# EAGLE design IRC2K16 (EAGLE 6.1)
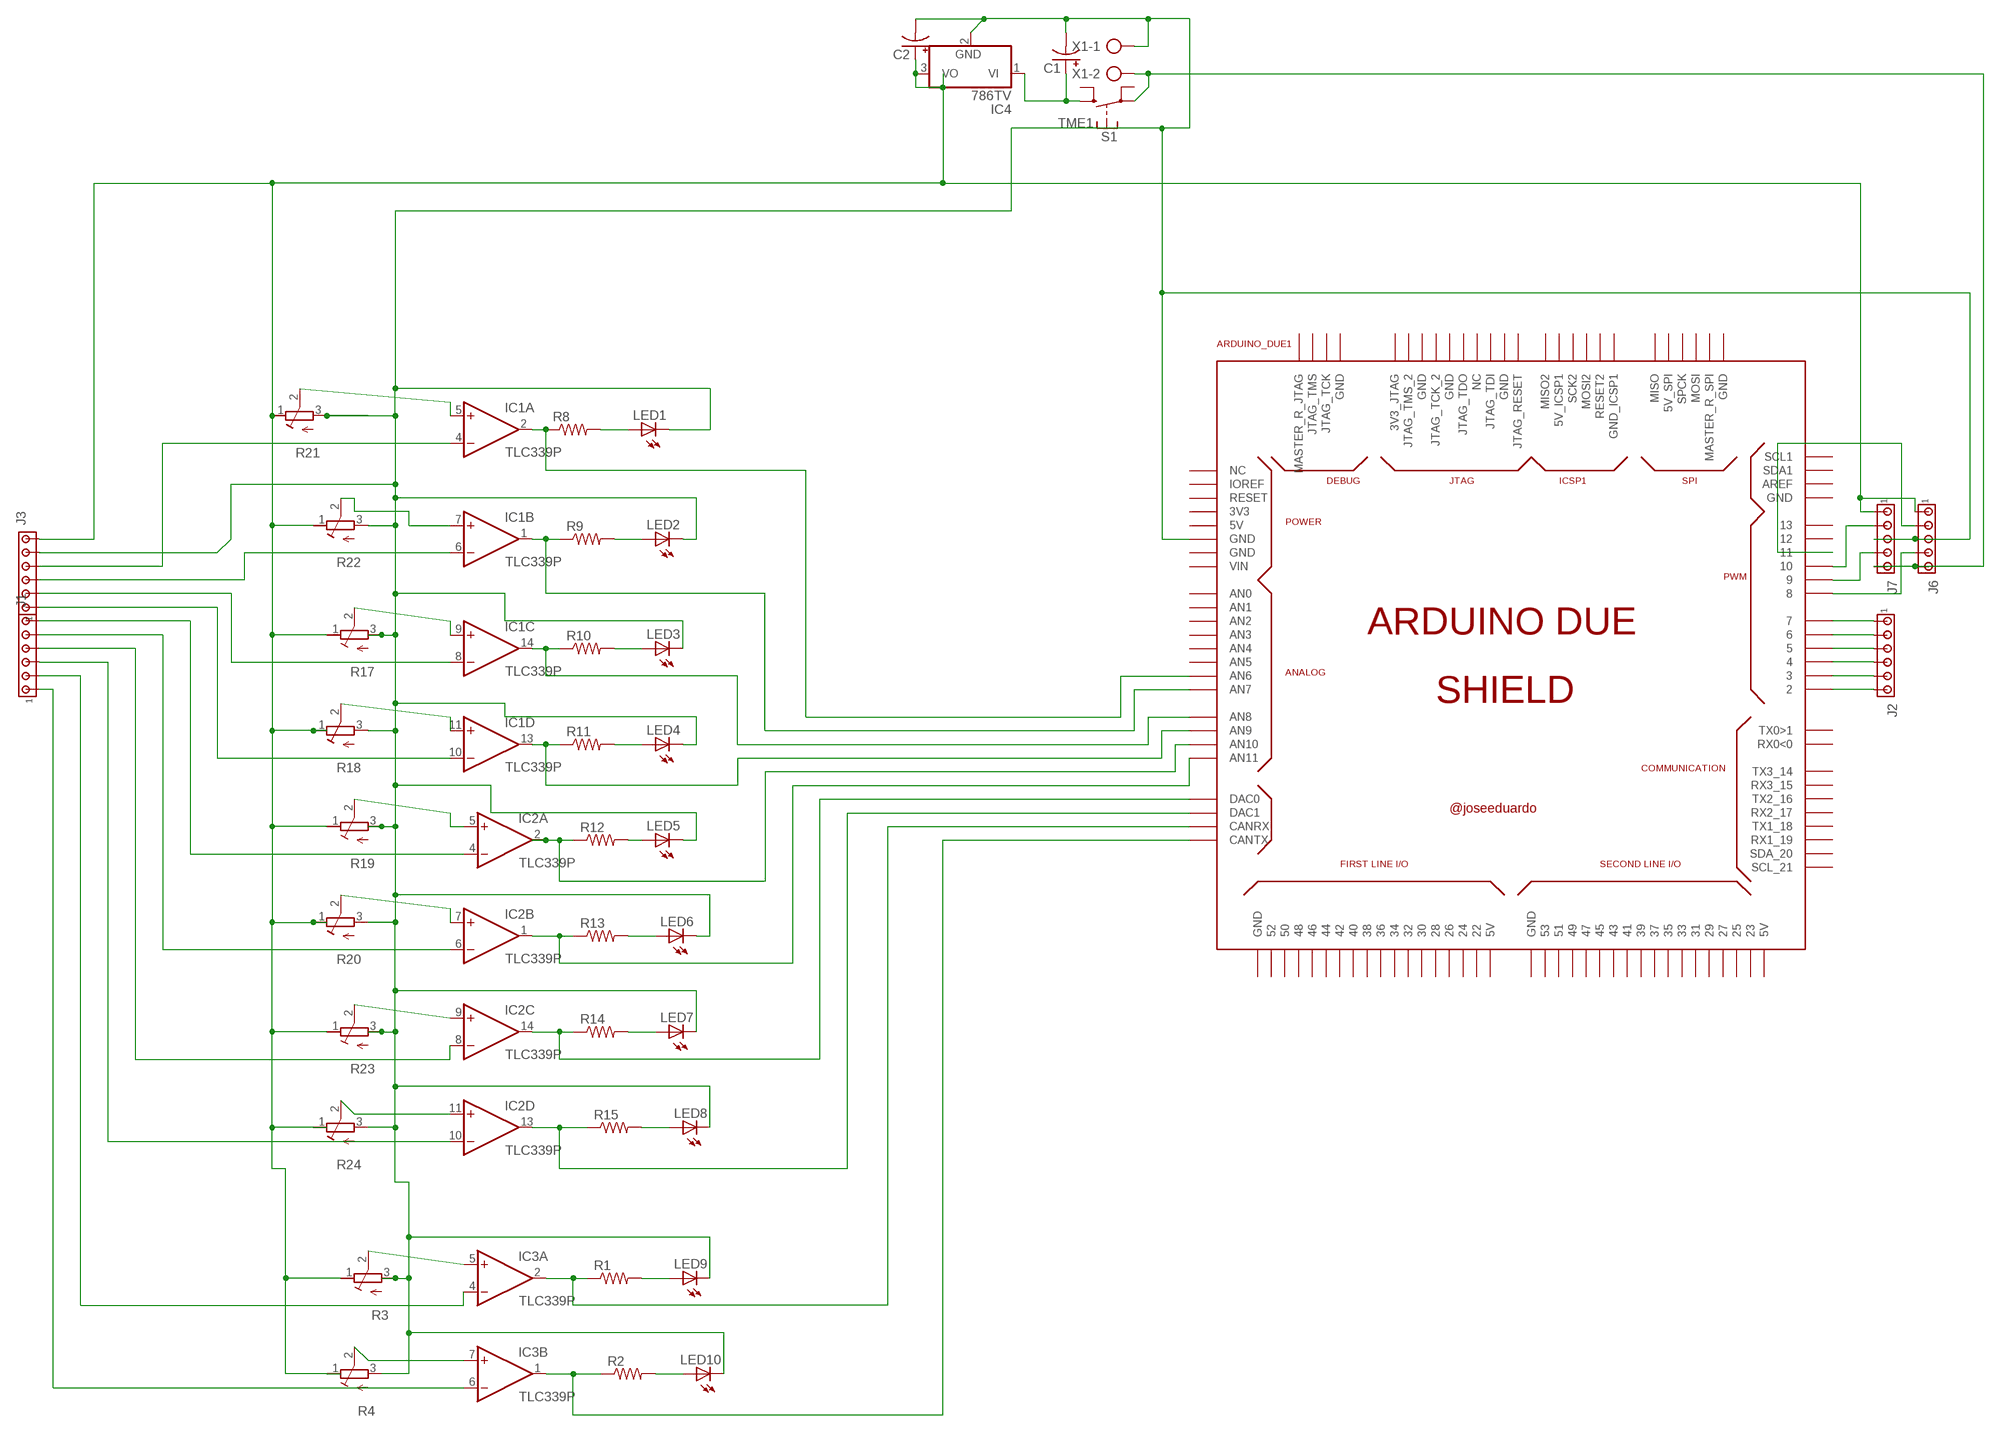
[diagram p0: schematic, sheet 1]

## Parts
ARDUINO_DUE1  ARDUINO_DUE_SHIELD  [ARDUINO_DUE_SHIELD]
C1  CPOL-USE5-10.5  [E5-10,5]
C2  CPOL-USE5-10.5  [E5-10,5]
IC1  TLC339P  [DIL14]
IC2  TLC339P  [DIL14]
IC3  TLC339P  [DIL14]
IC4  786TV  [TO220V]
J1  MTA06-100  [10X06MTA]
J2  MTA06-100  [10X06MTA]
J3  MTA06-100  [10X06MTA]
J6  MTA05-100  [10X05MTA]
J7  MTA05-100  [10X05MTA]
LED1  LED3MM  [LED3MM]
LED2  LED3MM  [LED3MM]
LED3  LED3MM  [LED3MM]
LED4  LED3MM  [LED3MM]
LED5  LED3MM  [LED3MM]
LED6  LED3MM  [LED3MM]
LED7  LED3MM  [LED3MM]
LED8  LED3MM  [LED3MM]
LED9  LED3MM  [LED3MM]
LED10  LED3MM  [LED3MM]
R1  R-US_0207/10  [0207/10]
R2  R-US_0207/10  [0207/10]
R3  R-TRIMMT93YA  [RTRIMT93YA]
R4  R-TRIMMT93YA  [RTRIMT93YA]
R8  R-US_0207/10  [0207/10]
R9  R-US_0207/10  [0207/10]
R10  R-US_0207/10  [0207/10]
R11  R-US_0207/10  [0207/10]
R12  R-US_0207/10  [0207/10]
R13  R-US_0207/10  [0207/10]
R14  R-US_0207/10  [0207/10]
R15  R-US_0207/10  [0207/10]
R17  R-TRIMMT93YA  [RTRIMT93YA]
R18  R-TRIMMT93YA  [RTRIMT93YA]
R19  R-TRIMMT93YA  [RTRIMT93YA]
R20  R-TRIMMT93YA  [RTRIMT93YA]
R21  R-TRIMMT93YA  [RTRIMT93YA]
R22  R-TRIMMT93YA  [RTRIMT93YA]
R23  R-TRIMMT93YA  [RTRIMT93YA]
R24  R-TRIMMT93YA  [RTRIMT93YA]
S1  TME1  [TME1]
X1  AK300/2  [AK300/2]

## Nets
N$1: ARDUINO_DUE1.7 J2.6
N$2: IC1.4(A:-IN) J3.3
N$3: ARDUINO_DUE1.6 J2.5
N$4: IC1.6(B:-IN) J3.4
N$5: IC1.7(B:+IN) R22.2(S)
N$6: IC1.5(A:+IN) R21.2(S)
N$7: IC1.9(C:+IN) R17.2(S)
N$8: IC1.11(D:+IN) R18.2(S)
N$9: IC2.5(A:+IN) R19.2(S)
N$10: IC2.7(B:+IN) R20.2(S)
N$11: IC2.9(C:+IN) R23.2(S)
N$12: IC2.11(D:+IN) R24.2(S)
N$13: ARDUINO_DUE1.A6(AN6) IC1.2(A:OUT) R8.1
N$14: LED1.A R8.2
N$15: ARDUINO_DUE1.A7(AN7) IC1.1(B:OUT) R9.1
N$16: LED2.A R9.2
N$17: ARDUINO_DUE1.A8(AN8) IC1.14(C:OUT) R10.1
N$18: LED3.A R10.2
N$19: ARDUINO_DUE1.A9(AN9) IC1.13(D:OUT) R11.1
N$20: ARDUINO_DUE1.A10(AN10) IC2.2(A:OUT) R12.1
N$21: ARDUINO_DUE1.A11(AN11) IC2.1(B:OUT) R13.1
N$22: ARDUINO_DUE1.DAC0 IC2.14(C:OUT) R14.1
N$23: LED4.A R11.2
N$24: LED5.A R12.2
N$25: LED6.A R13.2
N$26: LED7.A R14.2
N$27: ARDUINO_DUE1.DAC1 IC2.13(D:OUT) R15.1
N$28: LED8.A R15.2
N$29: IC1.8(C:-IN) J3.5
N$30: ARDUINO_DUE1.5 J2.4
N$31: IC1.10(D:-IN) J3.6
N$32: IC2.4(A:-IN) J1.1
N$33: IC2.6(B:-IN) J1.2
N$34: IC2.8(C:-IN) J1.3
N$35: ARDUINO_DUE1.4 J2.3
N$36: ARDUINO_DUE1.3 J2.2
N$37: ARDUINO_DUE1.2 J2.1
N$38: IC2.10(D:-IN) J1.4
N$39: J6.5 J7.5 S1.2(P) X1.2
N$40: IC3.5(A:+IN) R3.2(S)
N$41: ARDUINO_DUE1.8 J6.4
N$42: IC3.7(B:+IN) R4.2(S)
N$43: ARDUINO_DUE1.CANRX IC3.2(A:OUT) R1.1
N$44: LED9.A R1.2
N$45: ARDUINO_DUE1.CANTX IC3.1(B:OUT) R2.1
N$46: LED10.A R2.2
N$47: IC3.4(A:-IN) J1.5
N$48: IC3.6(B:-IN) J1.6
N$49: C2.+ IC4.3(VO) J3.1 J6.1 J7.1 R3.1(A) R4.1(A) R17.1(A) R18.1(A) R19.1(A) R20.1(A) R21.1(A) R22.1(A) R23.1(A) R24.1(A)
N$55: ARDUINO_DUE1.GND C1.- C2.- IC4.2(GND) J3.2 J6.3 J7.3 LED1.K(C) LED2.K(C) LED3.K(C) LED4.K(C) LED5.K(C) LED6.K(C) LED7.K(C) LED8.K(C) LED9.K(C) LED10.K(C) R3.3(E) R4.3(E) R17.3(E) R18.3(E) R19.3(E) R20.3(E) R21.3(E) R22.3(E) R23.3(E) R24.3(E) X1.1
N$60: ARDUINO_DUE1.10 J7.2
N$61: ARDUINO_DUE1.11 J6.2
N$62: ARDUINO_DUE1.9 J7.4
N$63: C1.+ IC4.1(VI) S1.1(S)
Unconnected: ARDUINO_DUE1.0(RX0<0) ARDUINO_DUE1.1(TX0>1) ARDUINO_DUE1.3V3 ARDUINO_DUE1.3V3_JTAG ARDUINO_DUE1.5V0(5V) ARDUINO_DUE1.5V0_1(5V) ARDUINO_DUE1.5V0_2(5V) ARDUINO_DUE1.5V_2(5V_SPI) ARDUINO_DUE1.5V_ICSP1 ARDUINO_DUE1.12 ARDUINO_DUE1.13 ARDUINO_DUE1.14(TX3_14) ARDUINO_DUE1.15(RX3_15) ARDUINO_DUE1.16(TX2_16) ARDUINO_DUE1.17(RX2_17) ARDUINO_DUE1.18(TX1_18) ARDUINO_DUE1.19(RX1_19) ARDUINO_DUE1.20(SDA_20) ARDUINO_DUE1.21(SCL_21) ARDUINO_DUE1.22 ARDUINO_DUE1.23 ARDUINO_DUE1.24 ARDUINO_DUE1.25 ARDUINO_DUE1.26 ARDUINO_DUE1.27 ARDUINO_DUE1.28 ARDUINO_DUE1.29 ARDUINO_DUE1.30 ARDUINO_DUE1.31 ARDUINO_DUE1.32 ARDUINO_DUE1.33 ARDUINO_DUE1.34 ARDUINO_DUE1.35 ARDUINO_DUE1.36 ARDUINO_DUE1.37 ARDUINO_DUE1.38 ARDUINO_DUE1.39 ARDUINO_DUE1.40 ARDUINO_DUE1.41 ARDUINO_DUE1.42 ARDUINO_DUE1.43 ARDUINO_DUE1.44 ARDUINO_DUE1.45 ARDUINO_DUE1.46 ARDUINO_DUE1.47 ARDUINO_DUE1.48 ARDUINO_DUE1.49 ARDUINO_DUE1.50 ARDUINO_DUE1.51 ARDUINO_DUE1.52 ARDUINO_DUE1.53 ARDUINO_DUE1.A0(AN0) ARDUINO_DUE1.A1(AN1) ARDUINO_DUE1.A2(AN2) ARDUINO_DUE1.A3(AN3) ARDUINO_DUE1.A4(AN4) ARDUINO_DUE1.A5(AN5) ARDUINO_DUE1.AREF ARDUINO_DUE1.GND_1(GND) ARDUINO_DUE1.GND_2(GND) ARDUINO_DUE1.GND_3(GND) ARDUINO_DUE1.GND_4(GND) ARDUINO_DUE1.GND_5(GND) ARDUINO_DUE1.GND_7(GND) ARDUINO_DUE1.GND_8(GND) ARDUINO_DUE1.GND_9(GND) ARDUINO_DUE1.GND_10(GND) ARDUINO_DUE1.GND_ICSP1 ARDUINO_DUE1.IOREF ARDUINO_DUE1.JTAG_RESET ARDUINO_DUE1.JTAG_TCK ARDUINO_DUE1.JTAG_TCK_2 ARDUINO_DUE1.JTAG_TDI ARDUINO_DUE1.JTAG_TDO ARDUINO_DUE1.JTAG_TMS ARDUINO_DUE1.JTAG_TMS_2 ARDUINO_DUE1.MASTER_RESET_JTAG(MASTER_R_JTAG) ARDUINO_DUE1.MASTER_RESET_SPI(MASTER_R_SPI) ARDUINO_DUE1.MISO ARDUINO_DUE1.MISO2 ARDUINO_DUE1.MOSI ARDUINO_DUE1.MOSI2 ARDUINO_DUE1.NC_2(NC) ARDUINO_DUE1.NC_5(NC) ARDUINO_DUE1.RESET ARDUINO_DUE1.RESET2 ARDUINO_DUE1.SCK2 ARDUINO_DUE1.SCL1 ARDUINO_DUE1.SDA1 ARDUINO_DUE1.SPCK ARDUINO_DUE1.VIN IC3.8(C:-IN) IC3.9(C:+IN) IC3.10(D:-IN) IC3.11(D:+IN) IC3.13(D:OUT) IC3.14(C:OUT) S1.4(P) S1.5(S)

## Power pins joined to a net without a drawn wire
V+: IC1.3(P:V+) IC2.3(P:V+) IC3.3(P:V+)
V-: IC1.12(P:V-) IC2.12(P:V-) IC3.12(P:V-)

## Library data of the parts
ARDUINO_DUE1 = arduino_due_shield:ARDUINO_DUE_SHIELD
C1 C2 = adafruit:CPOL-US: POLARIZED CAPACITOR, American symbol
IC1-IC3 = linear:TLC339: COMPARATOR
IC4 = linear:78*: Positive VOLTAGE REGULATOR Source: http://cache.national.com/ds/LM/LM78L05.pdf http://www.fairchildsemi.com/ds/LM/LM7805.pdf
J1-J3 = con-amp:MTA06-100: AMP connector
J6 J7 = con-amp:MTA05-100: AMP connector
LED1-LED10 = adafruit:LED: LED OSRAM: - CHIPLED LG R971, LG N971, LY N971, LG Q971, LY Q971, LO R971, LY R971 LH N974, LH R974 LS Q976, LO Q976, LY Q976 LO Q996 - Hyper CHIPLED LW Q18S LB Q993, LB Q99A, LB R99A - SideLED LS A670, LO A670, LY A670, LG A670, LP A670 LB A673, LV A673, LT A673, LW A673 LH A674 LY A675 LS A676, LA A676, LO A676, LY A676, LW A676 LS A679, LY A679, LG A679 - Hyper Micro SIDELED® LS Y876, LA Y876, LO Y876, LY Y876 LT Y87S - SmartLED LW L88C, LW L88S LB L89C, LB L89S, LG L890 LS L89K, LO L89K, LY L89K LS L896, LA L896, LO L896, LY L896 - TOPLED LS T670, LO T670, LY T670, LG T670, LP T670 LSG T670, LSP T670, LSY T670, LOP T670, LYG T670 LG T671, LOG T671, LSG T671 LB T673, LV T673, LT T673, LW T673 LH T674 LS T676, LA T676, LO T676, LY T676, LB T676, LH T676, LSB T676, LW T676 LB T67C, LV T67C, LT T67C, LS T67K, LO T67K, LY T67K, LW E67C LS E67B, LA E67B, LO E67B, LY E67B, LB E67C, LV E67C, LT E67C LW T67C LS T679, LY T679, LG T679 LS T770, LO T770, LY T770, LG T770, LP T770 LB T773, LV T773, LT T773, LW T773 LH T774 LS E675, LA E675, LY E675, LS T675 LS T776, LA T776, LO T776, LY T776, LB T776 LHGB T686 LT T68C, LB T68C - Hyper Mini TOPLED® LB M676 - Mini TOPLED Santana® LG M470 LS M47K, LO M47K, LY M47K Source: http://www.osram.convergy.de/
R1 R2 R8-R15 = adafruit:R-US_: RESISTOR, American symbol
R3 R4 R17-R24 = rcl:R-TRIMM: Trimm resistor
S1 = switch-misc:TME1: SWITCH
X1 = con-ptr500:AK300/2: CONNECTOR

## Board
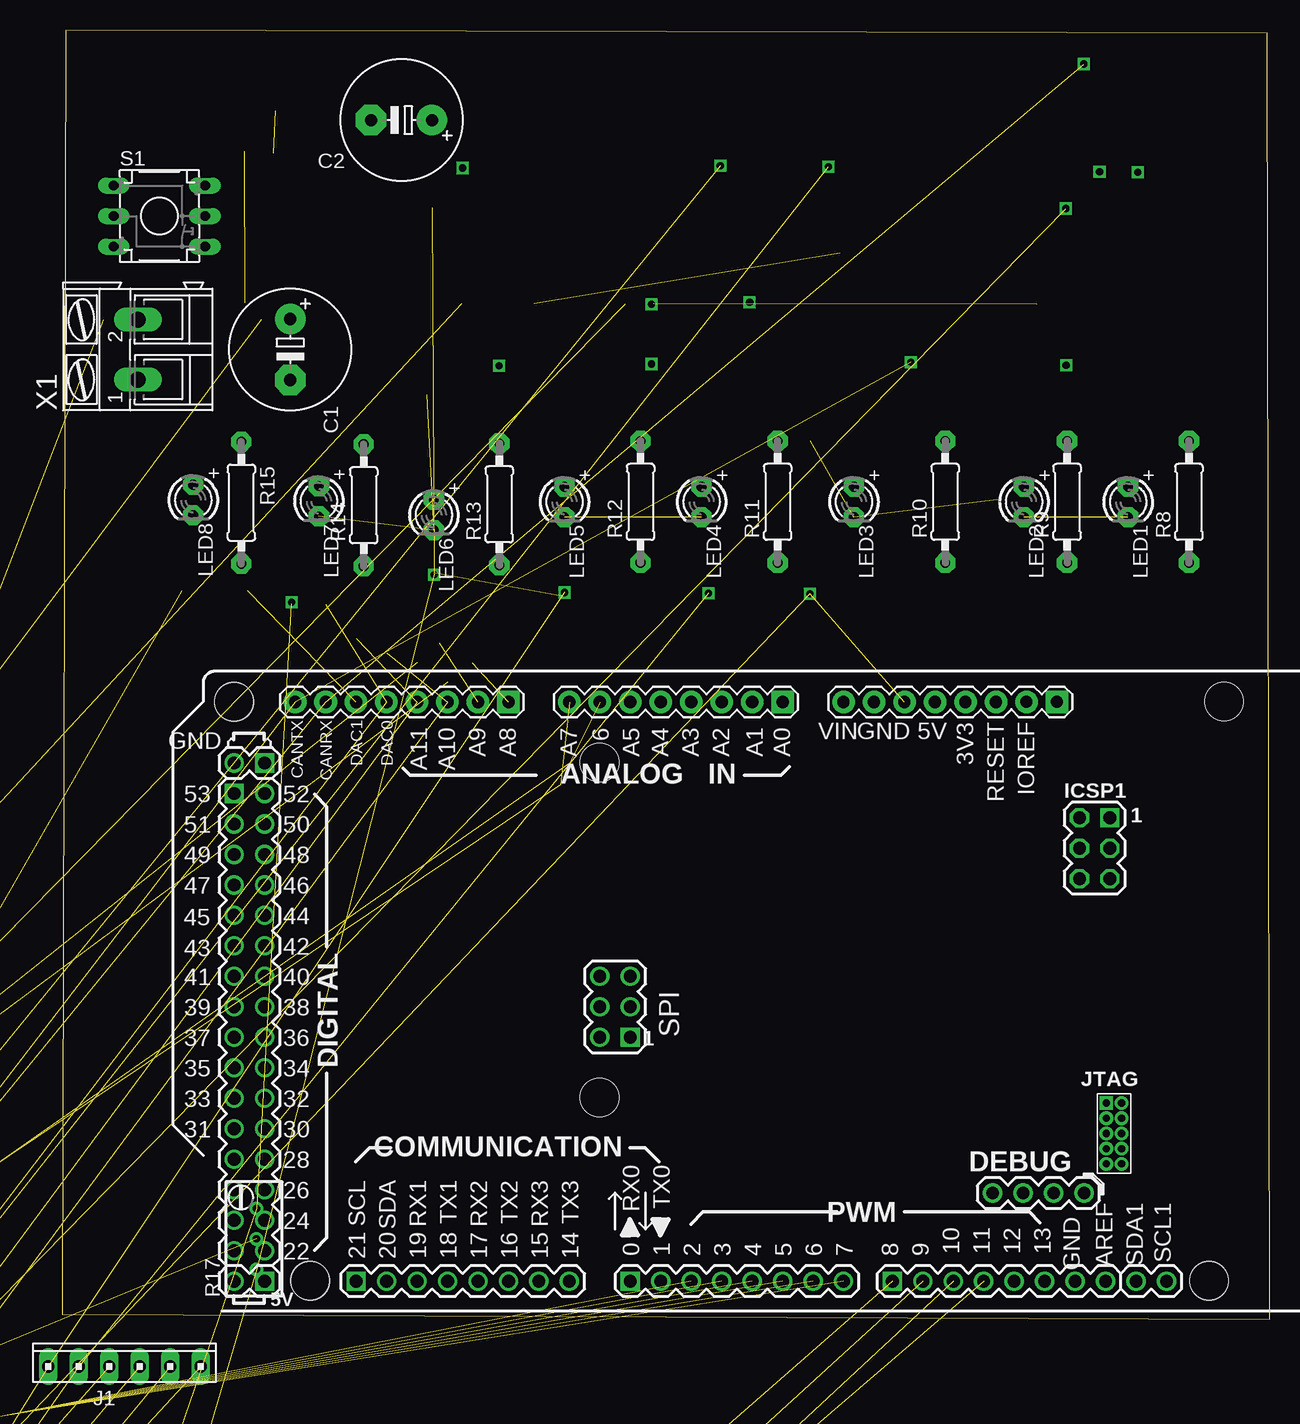
[diagram p1: board, top side]
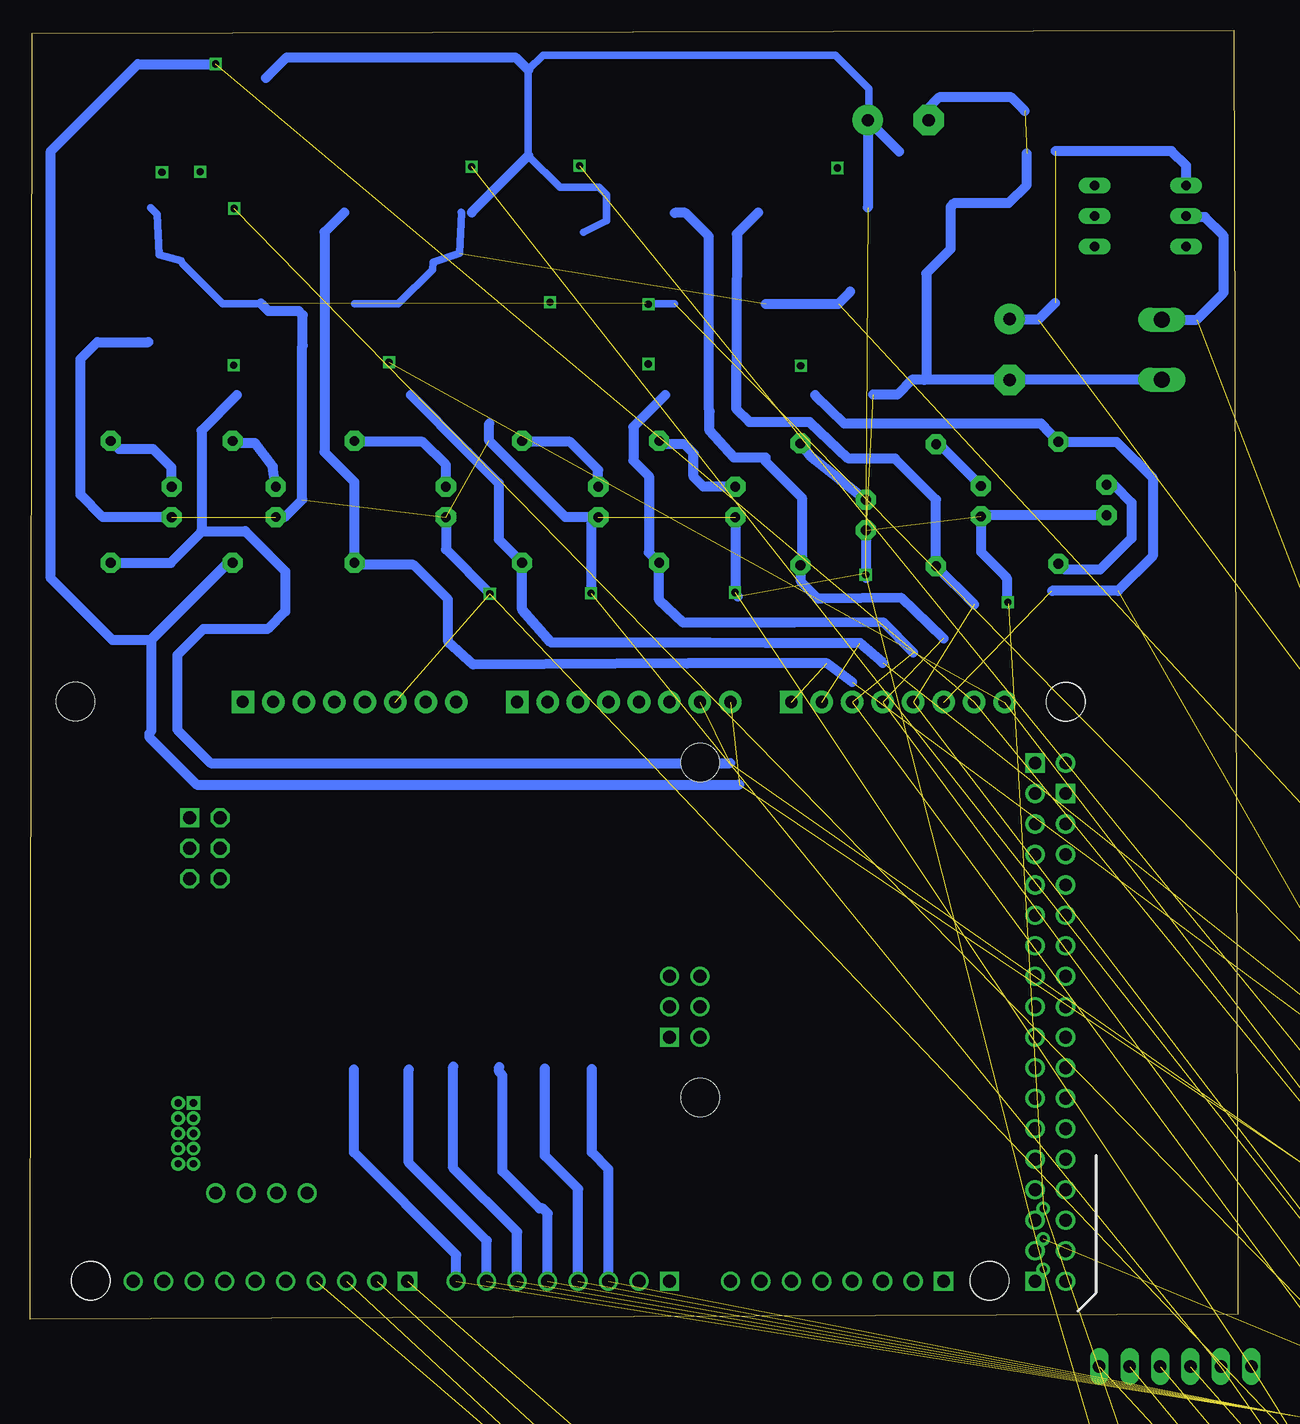
[diagram p2: board, bottom side, seen from below]

Size 100.68 x 107.43 mm. Coordinates in mm from the lower left corner, seen from the top.
Outline: 0,0.4 100.68,0 100.49,107.15 0.32,107.43 0,0.4
Copper layers (1*16): Top 0.035mm / dielectric 1.5mm / Bottom 0.035mm
Design rules: minimum track width 10mil, minimum drill 24mil, track to track 8mil, track to pad 8mil, pad to pad 8mil, via to via 8mil, smd to smd 8mil, copper to edge 40mil, drill to drill 8mil, minimum pad ring 10mil, minimum via ring 8mil, stop-mask expansion 4mil, vias tented up to drill 0mil, thermal gap 10mil

### Footprints (pad centres in the part's own frame; a part is rotated, then mirrored left to right if it is on the bottom)
ARDUINO_DUE_SHIELD = drill 1.067 square: 0 63.373,51.816; 5V0_1 93.853,51.816; 8 41.529,51.816; 21 86.233,51.816; 53 96.393,11.176; GND_2 93.853,8.636; MISO 63.373,31.496; MISO2 23.384,13.196 | drill 1.067: 1 60.833,51.816; 2 58.293,51.816; 3 55.753,51.816; 4 53.213,51.816; 5 50.673,51.816; 5V0_2 96.393,51.816; 5V_2 65.913,31.496; 6 48.133,51.816; 7 45.593,51.816; 9 38.989,51.816; 10 36.449,51.816; 11 33.909,51.816; 12 31.369,51.816; 13 28.829,51.816; 14 68.453,51.816; 15 70.993,51.816; 16 73.533,51.816; 17 76.073,51.816; 18 78.613,51.816; 19 81.153,51.816; 20 83.693,51.816; 22 93.853,49.276; 23 96.393,49.276; 24 93.853,46.736; 25 96.393,46.736; 26 93.853,44.196; 27 96.393,44.196; 28 93.853,41.656; 29 96.393,41.656; 30 93.853,39.116; 31 96.393,39.116; 32 93.853,36.576; 33 96.393,36.576; 34 93.853,34.036; 35 96.393,34.036; 36 93.853,31.496; 37 96.393,31.496; 38 93.853,28.956; 39 96.393,28.956; 40 93.853,26.416; 41 96.393,26.416; 42 93.853,23.876; 43 96.393,23.876; 44 93.853,21.336; 45 96.393,21.336; 46 93.853,18.796; 47 96.393,18.796; 48 93.853,16.256; 49 96.393,16.256; 50 93.853,13.716; 51 96.393,13.716; 52 93.853,11.176; AREF 23.749,51.816; GND_3 96.393,8.636; GND_4 26.289,51.816; GND_5 65.913,26.416; GND_7 33.161,44.473; JTAG_TCK 30.621,44.473; JTAG_TMS 28.081,44.473; MASTER_RESET_JTAG 25.541,44.473; MASTER_RESET_SPI 63.373,26.416; MOSI 65.913,28.956; SCL1 18.669,51.816; SDA1 21.209,51.816; SPCK 63.373,28.956 | drill 1.016 pad 1.88: 3V3 35.433,3.556; 5V0 37.973,3.556; A1 53.213,3.556; A2 55.753,3.556; A3 58.293,3.556; A4 60.833,3.556; A5 63.373,3.556; A6 65.913,3.556; A7 68.453,3.556; A9 76.073,3.556; A10 78.613,3.556; A11 81.153,3.556; CANRX 88.773,3.556; CANTX 91.313,3.556; DAC0 83.693,3.556; DAC1 86.233,3.556; GND 40.513,3.556; GND_1 43.053,3.556; IOREF 30.346,3.543; RESET 32.893,3.555; VIN 45.593,3.556 | drill 0.6 pad 1.016 square: 3V3_JTAG 23.689,36.964 | drill 1.067 octagon: 5V_ICSP1 25.924,13.196; GND_ICSP1 25.924,18.276; MOSI2 25.924,15.736; RESET2 23.384,18.276; SCK2 23.384,15.736 | drill 1.016 pad 1.88 square: A0 50.673,3.556; A8 73.533,3.556; NC_2 27.806,3.543 | drill 0.6 pad 1.143: GND_8 23.689,38.234; GND_9 23.689,40.774; GND_10 23.689,42.044; JTAG_RESET 22.419,42.044; JTAG_TCK_2 22.419,38.234; JTAG_TDI 22.419,40.774; JTAG_TDO 22.419,39.504; JTAG_TMS_2 22.419,36.964; NC_5 23.689,39.504 | hole 3.2: 15.113,51.816; 90.043,51.816; 96.393,3.556; 96.418,3.505; 15.138,51.765; 90.068,51.765; 13.868,3.505; 65.938,36.525; 65.938,8.585
E5-10,5 = drill 1.016 pad 2.54: + -2.54,0 | drill 1.016 pad 2.54 octagon: - 2.54,0
DIL14 = drill 0.813 long: 1 -7.62,-3.81; 2 -5.08,-3.81; 3 -2.54,-3.81; 4 0,-3.81; 5 2.54,-3.81; 6 5.08,-3.81; 7 7.62,-3.81; 8 7.62,3.81; 9 5.08,3.81; 10 2.54,3.81; 11 0,3.81; 12 -2.54,3.81; 13 -5.08,3.81; 14 -7.62,3.81
TO220V = drill 1.016 long: 1 -2.54,-2.54; 2 0,-2.54; 3 2.54,-2.54
10X06MTA = drill 1.016 long: 1 6.35,0; 2 3.81,0; 3 1.27,0; 4 -1.27,0; 5 -3.81,0; 6 -6.35,0
10X05MTA = drill 1.016 long: 1 5.08,0; 2 2.54,0; 3 0,0; 4 -2.54,0; 5 -5.08,0
LED3MM = drill 0.813 pad 1.676 octagon: A -1.27,0; K 1.27,0
0207/10 = drill 0.813 pad 1.676 octagon: 1 -5.08,0; 2 5.08,0
RTRIMT93YA = drill 0.61: 1 0,-2.54; 2 0,0; 3 0,2.54
TME1 = drill 0.813 long: 1 -2.54,-3.81; 2 0,-3.81; 3 2.54,-3.81; 4 2.54,3.81; 5 0,3.81; 6 -2.54,3.81
AK300/2 = drill 1.321 long: 1 -2.515,0; 2 2.489,0

### Placement (x,y rotation side)
ARDUINO_DUE1  110.74,54.99 180 top
C1  19.02,80.81 270 top
C2  28.3,99.92 180 top
IC1  -65.83,-28.98 0 top  (outside the outline)
IC2  -65.83,-84.05 0 top  (outside the outline)
IC3  -65.83,-95.79 0 top  (outside the outline)
IC4  -71.21,-34.84 0 top  (outside the outline)
J1  5.2,-3.94 0 top  (outside the outline)
J2  -68.81,-19.35 0 top  (outside the outline)
J3  5.2,-11.65 0 top  (outside the outline)
J6  -70.11,-120.91 0 top  (outside the outline)
J7  -70.11,-128.51 0 top  (outside the outline)
LED1  88.87,68.11 270 top
LED2  80.18,68.11 270 top
LED3  66.01,68.11 270 top
LED4  53.31,68.11 270 top
LED5  41.88,68.11 270 top
LED6  30.99,67.01 270 top
LED7  21.41,68.17 270 top
LED8  10.93,68.26 270 top
LED9  -74.14,-76.03 0 top  (outside the outline)
LED10  -61.92,-71.59 0 top  (outside the outline)
R1  -70.69,-68.2 0 top  (outside the outline)
R2  -70.69,-72.64 0 top  (outside the outline)
R3  -72.06,-59.58 0 top  (outside the outline)
R4  -65.05,-59.58 0 top  (outside the outline)
R8  93.95,68.11 90 top
R9  83.79,68.11 90 top
R10  73.63,68.11 90 top
R11  59.66,68.11 90 top
R12  48.23,68.11 90 top
R13  36.45,67.9 90 top
R14  25.15,67.83 90 top
R15  14.95,68.04 270 top
R17  16.21,6.7 0 top
R18  -16.55,-10.01 0 top  (outside the outline)
R19  -25.8,-10.01 0 top  (outside the outline)
R20  -35.06,-10.01 0 top  (outside the outline)
R21  -44.31,-10.01 0 top  (outside the outline)
R22  -53.56,-10.01 0 top  (outside the outline)
R23  -62.81,-10.01 0 top  (outside the outline)
R24  -72.06,-10.01 0 top  (outside the outline)
S1  8.11,91.93 270 top
X1  6.32,80.81 90 top

### Tracks (layer width: path | path; a pad name or v marks a point on that pad's centre or on a via)
N$1  (1 unrouted)
  Bottom 0.813: ARDUINO_DUE1.7 65.15,5.37 73.68,13.9 73.68,20.82
N$2  (1 unrouted)
N$3  (1 unrouted)
  Bottom 0.813: ARDUINO_DUE1.6 62.61,6.56 69.11,13.06 69.11,20.82
N$4  (1 unrouted)
N$5  (1 unrouted)
N$6  (1 unrouted)
N$7  (1 unrouted)
N$8  (1 unrouted)
N$9  (1 unrouted)
N$10  (1 unrouted)
N$11  (1 unrouted)
N$12  (1 unrouted)
N$13  (2 unrouted)
  Bottom 0.813: R8.1 88.95,63.03 86.31,65.67 | 86.31,65.67 82.74,65.67 79.4,62.33 79.4,58.99 80.88,57.51 86.23,57.51 88.4,55.34 88.4,49.13 85.61,46.33 42.31,46.33 | 83.43,77 86.38,74.05 86.38,65.74 86.31,65.67
N$14
  Bottom 0.813: LED1.A 88.87,70.96 90.41,72.5 93.26,72.5 R8.2
N$15  (2 unrouted)
  Bottom 0.813: 41.55,44.55 86.77,44.55 90.73,48.51 90.73,48.82 90.58,48.97 90.58,56.66 84.21,63.03 R9.1 84.12,63.03 90.56,56.58 93.8,56.58 98.95,61.73 98.95,97.34 91.68,104.6 85.31,104.6
N$16
  Bottom 0.813: LED2.A 80.44,71.07 81.92,73 83.6,73 R9.2
N$17  (2 unrouted)
  Bottom 0.813: 32.13,53.08 34.23,54.64 45.88,54.64 63.71,54.54 65.81,56.44 65.84,59.99 68.71,62.86 73.47,62.87 R10.1 73.65,63.05 73.65,69.77 76.13,72.25 76.13,90.58 74.47,92.24
N$18
  Bottom 0.813: LED3.A 66.01,71.18 67.94,73.11 73.55,73.11 R10.2
N$19  (2 unrouted)
  Bottom 0.813: 29.59,54.68 31.49,56.35 39.34,56.35 44.01,56.38 57.24,56.39 59.65,59.11 59.64,63.01 R11.1 61.61,64.98 61.61,69.68 64.18,72.25 68.93,77
N$20  (2 unrouted)
  Bottom 0.813: 27.05,55.54 29.55,58.07 36.97,58.04 46.21,58.04 48.23,59.95 R12.1 49.08,63.88 49.08,70.25 50.37,71.55 50.37,74.35 47.72,77
N$21  (2 unrouted)
  Bottom 0.813: 24.53,56.75 28.04,60.1 34.7,60.04 34.97,60.04 36.41,61.47 36.41,62.78 R13.1 36.33,62.95 36.33,68.46 39.36,71.49 39.36,71.8 41.99,71.8 44.02,74.02 44.02,75.62 44.08,75.98 44.08,90.25 46.03,92.2 46.92,92.2
N$22  (2 unrouted)
  Bottom 0.813: 39.96,92.24 41.76,90.44 41.81,75.89 40.72,74.8 40.71,74.76 35.67,74.76 32.45,71.72 28.57,71.72 25.15,68.3 R14.1 21.97,59.57
N$23
  Bottom 0.813: LED4.A 53.31,70.77 55.65,73.11 59.58,73.11 R11.2
N$24
  Bottom 0.813: LED5.A 44.54,69.38 45.36,70.2 45.36,72.14 46.11,72.9 47.93,72.9 R12.2
N$25
  Bottom 0.813: R13.2 35.69,72.01 LED6.A
N$26
  Bottom 0.813: R14.2 24.88,72.91 LED7.A
N$27  (2 unrouted)
  Bottom 0.813: 35.22,77 32.81,74.66 16.41,74.66 R15.1 10.11,73.12 7.1,70.11 7.1,63.58 9.98,60.69 15.49,60.69
N$28
  Bottom 0.813: LED8.A 10.34,69.53 8.87,68.06 8.87,65.07 11.47,62.46 14.45,62.46 R15.2
N$29  (1 unrouted)
N$30  (1 unrouted)
  Bottom 0.813: ARDUINO_DUE1.5 60.07,7.27 65.39,12.59 65.39,21.06
N$31  (1 unrouted)
N$32  (1 unrouted)
N$33  (1 unrouted)
N$34  (1 unrouted)
N$35  (1 unrouted)
  Bottom 0.813: ARDUINO_DUE1.4 57.53,8.83 57.94,9.24 58.21,9.24 61.29,12.31 61.29,20.33 61.57,20.61 61.57,21.04
N$36  (1 unrouted)
  Bottom 0.813: ARDUINO_DUE1.3 54.99,10.86 57.75,13.62 57.75,20.89
N$37  (1 unrouted)
  Bottom 0.813: ARDUINO_DUE1.2 52.45,12.51 53.84,13.9 53.84,20.84
N$38  (1 unrouted)
N$39  (2 unrouted)
  Bottom 0.813: X1.2 3.42,83.3 1.17,85.55 1.17,90.28 2.73,91.83 4.21,91.83 S1.2
N$40  (via drill 0.6 pad 0.61)  (2 unrouted)
  other vias: 54.88,96.11
N$41  (1 unrouted)
N$42  (via drill 0.6 pad 0.61)  (2 unrouted)
  other vias: 83.67,92.56
N$43  (via drill 0.6 pad 0.61)  (3 unrouted)
  other vias: 85.19,104.6
N$44  (via drill 0.6 pad 0.61)  (2 unrouted)
  other vias: 63.88,96.04
N$45  (via drill 0.6 pad 0.61)  (3 unrouted)
  other vias: 70.76,79.74
N$46  (via drill 0.6 pad 0.61)  (2 unrouted)
  other vias: 62.35,60.46
N$47  (via drill 0.6 pad 0.61)  (2 unrouted)
  other vias: 53.9,60.5
N$48  (via drill 0.6 pad 0.61)  (2 unrouted)
  other vias: 41.9,60.56
N$49  (via drill 0.6 pad 0.61)  (15 unrouted)
  Bottom 0.61: 54.53,90.6 52.63,91.52 52.63,93.7 53.25,94.32 56.51,94.32 59.15,96.96 59.15,104.1 57.9,105.35 33.54,105.35 30.74,102.55 30.74,99.52 30.66,99.44 30.66,99.75 C2.+
  Bottom 0.813: 28.23,97.32 C2.+ 30.84,92.63 | 63.87,92.24 59.15,96.96 | 80.99,103.43 79.27,105.16 60.2,105.16 59.15,104.1
  other vias: 31.01,62.04
N$50  (via drill 0.6 pad 0.61)
  other vias: 19.15,59.74
N$51  (via drill 0.6 pad 0.61)
  other vias: 49.13,79.6
N$52  (via drill 0.6 pad 0.61)
  other vias: 33.38,95.93
N$53  (via drill 0.6 pad 0.61)
  other vias: 36.43,79.45
N$54  (via drill 0.6 pad 0.61)
  other vias: 89.68,95.57
N$55  (25 unrouted)
  Bottom 0.813: X1.1 19.02,78.3 C1.- 26.12,78.27 | 17.75,100.69 18.88,101.82 24.9,101.82 26,100.72 26,100.16 C2.- | 17.59,97.16 17.59,94.51 19.08,93.02 23.6,93.02 23.93,92.7 23.93,89.2 25.97,87.16 25.97,78.42 26.12,78.27 | 26.12,78.27 27.16,78.27 28.39,77.04 30.41,77.04 | LED8.K 21.31,66.99 LED7.K 21.41,63.94 | LED1.K 94.61,66.84 96.47,68.7 96.47,80.03 95.07,81.43 90.79,81.43 | 62.4,74.66 62.4,73.2 56.04,66.84 LED4.K 53.87,66.28 53.87,60.39 53.95,60.47 | 81.45,84.66 80.79,84.01 78.27,84.01 77.95,83.68 77.95,81.13 77.99,81.08 77.99,68.31 79.46,66.84 LED2.K | LED6.K 30.99,62.31 | 30.99,62.31 31.13,62.17 | 21.41,63.94 19.33,61.86 | LED5.K 41.88,60.97 42,60.85 42,60.54 41.68,60.23 | 30.99,62.31 30.99,61.8 30.98,61.79 | 21.41,63.94 | 21.41,63.94 19.26,61.79 19.26,59.77 19.1,59.61 | LED3.K 66.01,64.15 62.33,60.47
N$56  (via drill 0.6 pad 0.61)
  other vias: 86.49,95.62
N$57  (via drill 0.6 pad 0.61)
  other vias: 83.71,79.49
N$58  (via drill 0.6)
  other vias: 49.13,84.58
N$59  (via drill 0.6)
  other vias: 57.32,84.75
N$60  (1 unrouted)
N$61  (1 unrouted)
N$62  (1 unrouted)
N$63  (2 unrouted)
  Bottom 0.813: S1.1 4.3,96.13 5.52,97.35 15.18,97.35 | 15.21,84.7 16.62,83.29 18.96,83.29 C1.+
V+  (4 unrouted)
  Bottom 0.61: 81.25,84.62 84.61,84.62 87.94,87.95 88.07,88.19 89.9,88.7 90.06,92.07 90.6,92.61 | 46.96,84.62 49.26,84.62 49.31,84.66
V-  (4 unrouted)
  Bottom 0.61: 73.63,84.62 69.98,84.62 67.13,87.47 67.08,88.07 64.85,88.84 64.69,92.2 64.74,92.25
  Bottom 0.813: 39.34,84.62 33.3,84.62 32.29,85.62